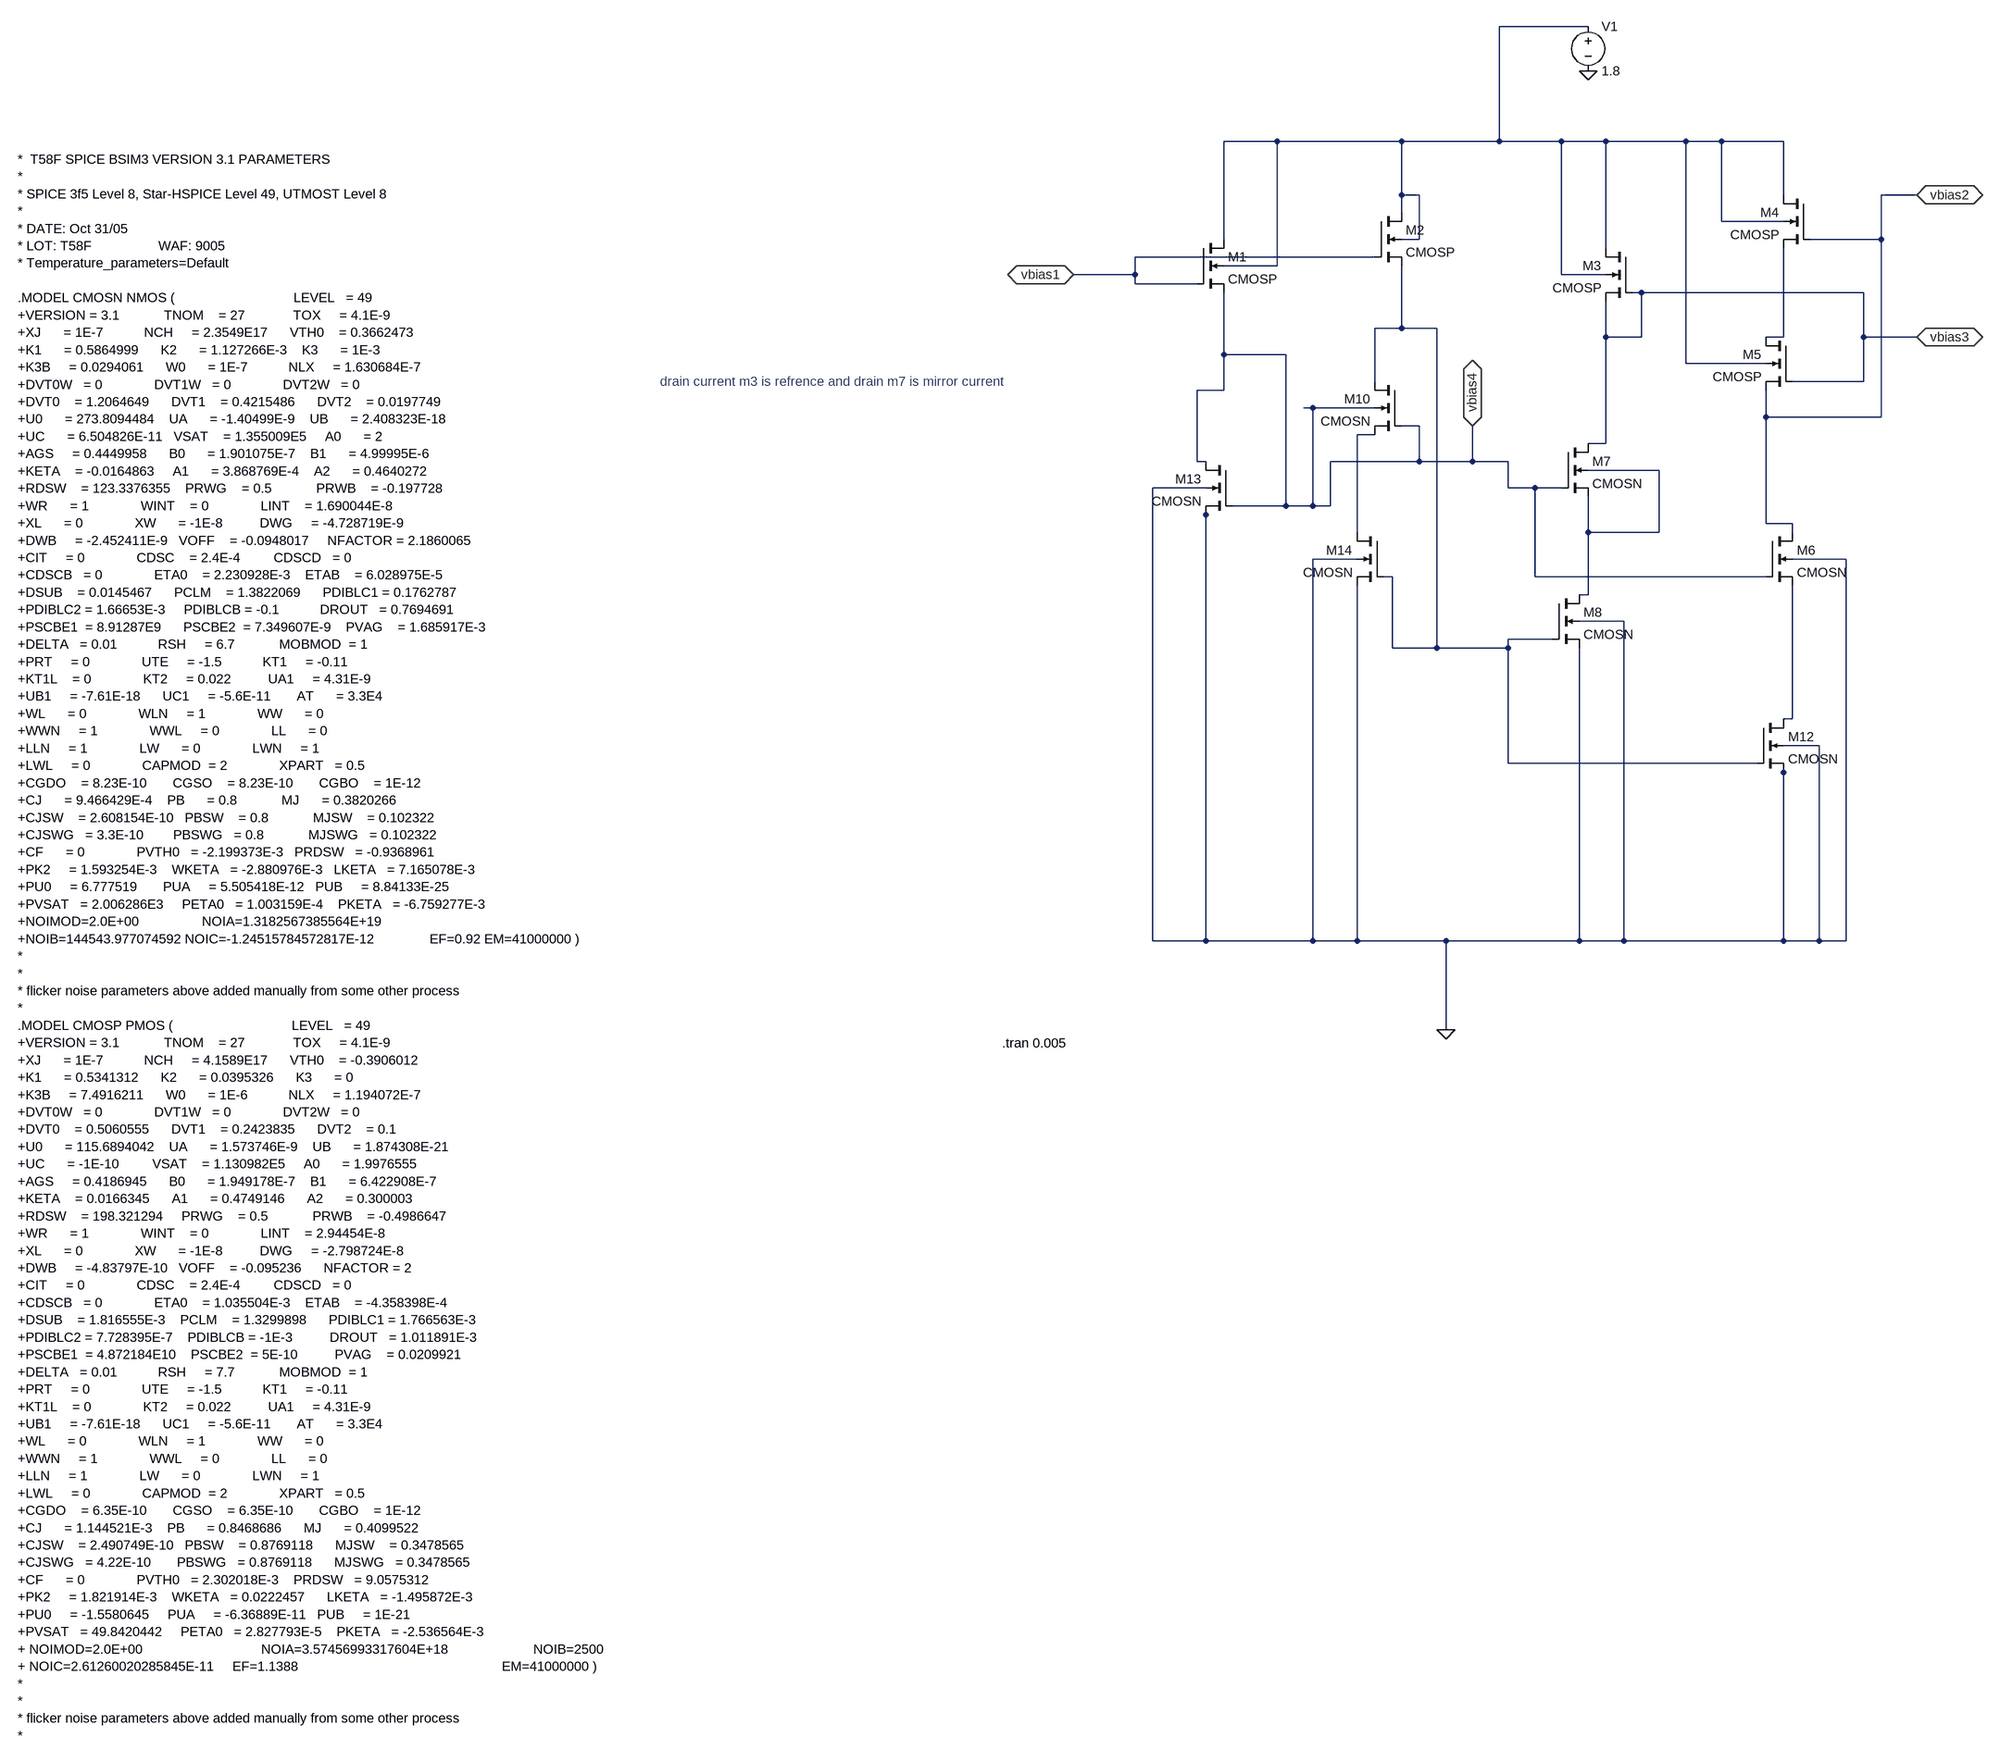
[diagram p0: schematic CURRENTMIRROR.asc]
CURRENTMIRROR.asc, the LTspice schematic file:
Version 4
SHEET 1 1432 2468
WIRE 704 -352 544 -352
WIRE 144 -128 48 -128
WIRE 368 -128 144 -128
WIRE 544 -128 544 -352
WIRE 544 -128 368 -128
WIRE 656 -128 544 -128
WIRE 736 -128 656 -128
WIRE 880 -128 736 -128
WIRE 944 -128 880 -128
WIRE 1056 -128 944 -128
WIRE 368 -32 368 -128
WIRE 400 -32 368 -32
WIRE 1056 -32 1056 -128
WIRE 1296 -32 1232 -32
WIRE 368 0 368 -32
WIRE 944 16 944 -128
WIRE 1056 16 944 16
WIRE 48 48 48 -128
WIRE 400 48 400 -32
WIRE 400 48 368 48
WIRE 1232 48 1232 -32
WIRE 1232 48 1104 48
WIRE 736 64 736 -128
WIRE 320 80 -112 80
WIRE 144 96 144 -128
WIRE 144 96 48 96
WIRE -112 112 -112 80
WIRE -112 112 -256 112
WIRE 656 112 656 -128
WIRE 736 112 656 112
WIRE -112 128 -112 112
WIRE 0 128 -112 128
WIRE 800 144 784 144
WIRE 1200 144 800 144
WIRE 368 208 368 96
WIRE 368 208 320 208
WIRE 432 208 368 208
WIRE 736 224 736 160
WIRE 800 224 800 144
WIRE 800 224 736 224
WIRE 1056 224 1056 64
WIRE 1056 224 1024 224
WIRE 1200 224 1200 144
WIRE 1296 224 1200 224
WIRE 48 256 48 144
WIRE 160 256 48 256
WIRE 880 272 880 -128
WIRE 1024 272 880 272
WIRE 320 304 320 208
WIRE 1200 304 1200 224
WIRE 1200 304 1072 304
WIRE 48 320 48 256
WIRE 48 320 0 320
WIRE 208 352 192 352
WIRE 320 352 208 352
WIRE 1024 368 1024 320
WIRE 1232 368 1232 48
WIRE 1232 368 1024 368
WIRE 400 384 368 384
WIRE 320 400 288 400
WIRE 736 416 736 224
WIRE 736 416 704 416
WIRE 0 448 0 320
WIRE 16 448 0 448
WIRE 400 448 400 384
WIRE 400 448 240 448
WIRE 496 448 496 384
WIRE 496 448 400 448
WIRE 560 448 496 448
WIRE 832 464 704 464
WIRE 16 496 -80 496
WIRE 560 496 560 448
WIRE 608 496 560 496
WIRE 656 496 608 496
WIRE 160 528 160 256
WIRE 160 528 64 528
WIRE 208 528 208 352
WIRE 208 528 160 528
WIRE 240 528 240 448
WIRE 240 528 208 528
WIRE 16 544 16 528
WIRE 1024 560 1024 368
WIRE 1072 560 1024 560
WIRE 288 576 288 400
WIRE 704 576 704 512
WIRE 832 576 832 464
WIRE 832 576 704 576
WIRE 1072 576 1072 560
WIRE 288 624 208 624
WIRE 1168 624 1072 624
WIRE 352 656 336 656
WIRE 608 656 608 496
WIRE 1024 656 608 656
WIRE 704 688 704 576
WIRE 704 688 688 688
WIRE 768 736 688 736
WIRE 640 768 560 768
WIRE 352 784 352 656
WIRE 432 784 432 208
WIRE 432 784 352 784
WIRE 560 784 560 768
WIRE 560 784 432 784
WIRE 1072 912 1072 672
WIRE 1072 912 1056 912
WIRE 1120 960 1056 960
WIRE 560 992 560 784
WIRE 1008 992 560 992
WIRE 1056 1008 1056 992
WIRE -80 1312 -80 496
WIRE 16 1312 16 544
WIRE 16 1312 -80 1312
WIRE 208 1312 208 624
WIRE 208 1312 16 1312
WIRE 288 1312 288 672
WIRE 288 1312 208 1312
WIRE 448 1312 288 1312
WIRE 688 1312 688 784
WIRE 688 1312 448 1312
WIRE 768 1312 768 736
WIRE 768 1312 688 1312
WIRE 1056 1312 1056 1008
WIRE 1056 1312 768 1312
WIRE 1120 1312 1120 960
WIRE 1120 1312 1056 1312
WIRE 1168 1312 1168 624
WIRE 1168 1312 1120 1312
WIRE 448 1472 448 1312
FLAG -256 112 vbias1
IOPIN -256 112 BiDir
FLAG 496 384 vbias4
IOPIN 496 384 BiDir
FLAG 1296 224 vbias3
IOPIN 1296 224 BiDir
FLAG 1296 -32 vbias2
IOPIN 1296 -32 BiDir
FLAG 704 -272 0
FLAG 448 1472 0
DATAFLAG 736 272 ""
DATAFLAG 736 16 ""
SYMBOL nmos4 0 48 R0
SYMATTR InstName M1
SYMATTR Value CMOSP
SYMATTR Value2 l=2u w=24u
SYMBOL nmos4 320 0 R0
SYMATTR InstName M2
SYMATTR Value CMOSP
SYMATTR Value2 l=2u w=24u
SYMBOL nmos4 656 416 R0
SYMATTR InstName M7
SYMATTR Value CMOSN
SYMATTR Value2 l=2u w=10u
SYMBOL nmos4 640 688 R0
SYMATTR InstName M8
SYMATTR Value CMOSN
SYMATTR Value2 l=2u w=10u
SYMBOL nmos4 784 64 M0
SYMATTR InstName M3
SYMATTR Value CMOSP
SYMATTR Value2 l=2u w=24u
SYMBOL nmos4 1104 -32 M0
SYMATTR InstName M4
SYMATTR Value CMOSP
SYMATTR Value2 l=2u w=24u
SYMBOL nmos4 1024 576 R0
SYMATTR InstName M6
SYMATTR Value CMOSN
SYMATTR Value2 l=2u w=10u
SYMBOL nmos4 1008 912 R0
SYMATTR InstName M12
SYMATTR Value CMOSN
SYMATTR Value2 l=2u w=10u
SYMBOL nmos4 368 304 M0
SYMATTR InstName M10
SYMATTR Value CMOSN
SYMATTR Value2 l=2u w=10u
SYMBOL nmos4 64 448 M0
SYMATTR InstName M13
SYMATTR Value CMOSN
SYMATTR Value2 l=2u w=10u
SYMBOL nmos4 336 576 M0
SYMATTR InstName M14
SYMATTR Value CMOSN
SYMATTR Value2 l=2u w=10u
SYMBOL nmos4 1072 224 M0
SYMATTR InstName M5
SYMATTR Value CMOSP
SYMATTR Value2 l=2u w=24u
SYMBOL voltage 704 -368 R0
WINDOW 123 0 0 Left 0
WINDOW 39 0 0 Left 0
SYMATTR InstName V1
SYMATTR Value 1.8
TEXT -384 1496 Left 2 !.tran 0.005
TEXT -4040 -96 Left 2 !*  T58F SPICE BSIM3 VERSION 3.1 PARAMETERS\n* \n* SPICE 3f5 Level 8, Star-HSPICE Level 49, UTMOST Level 8\n* \n* DATE: Oct 31/05\n* LOT: T58F                  WAF: 9005\n* Temperature_parameters=Default\n \n.MODEL CMOSN NMOS (                                LEVEL   = 49\n+VERSION = 3.1            TNOM    = 27             TOX     = 4.1E-9\n+XJ      = 1E-7           NCH     = 2.3549E17      VTH0    = 0.3662473\n+K1      = 0.5864999      K2      = 1.127266E-3    K3      = 1E-3\n+K3B     = 0.0294061      W0      = 1E-7           NLX     = 1.630684E-7\n+DVT0W   = 0              DVT1W   = 0              DVT2W   = 0\n+DVT0    = 1.2064649      DVT1    = 0.4215486      DVT2    = 0.0197749\n+U0      = 273.8094484    UA      = -1.40499E-9    UB      = 2.408323E-18\n+UC      = 6.504826E-11   VSAT    = 1.355009E5     A0      = 2\n+AGS     = 0.4449958      B0      = 1.901075E-7    B1      = 4.99995E-6\n+KETA    = -0.0164863     A1      = 3.868769E-4    A2      = 0.4640272\n+RDSW    = 123.3376355    PRWG    = 0.5            PRWB    = -0.197728\n+WR      = 1              WINT    = 0              LINT    = 1.690044E-8\n+XL      = 0              XW      = -1E-8          DWG     = -4.728719E-9\n+DWB     = -2.452411E-9   VOFF    = -0.0948017     NFACTOR = 2.1860065\n+CIT     = 0              CDSC    = 2.4E-4         CDSCD   = 0\n+CDSCB   = 0              ETA0    = 2.230928E-3    ETAB    = 6.028975E-5\n+DSUB    = 0.0145467      PCLM    = 1.3822069      PDIBLC1 = 0.1762787\n+PDIBLC2 = 1.66653E-3     PDIBLCB = -0.1           DROUT   = 0.7694691\n+PSCBE1  = 8.91287E9      PSCBE2  = 7.349607E-9    PVAG    = 1.685917E-3\n+DELTA   = 0.01           RSH     = 6.7            MOBMOD  = 1\n+PRT     = 0              UTE     = -1.5           KT1     = -0.11\n+KT1L    = 0              KT2     = 0.022          UA1     = 4.31E-9\n+UB1     = -7.61E-18      UC1     = -5.6E-11       AT      = 3.3E4\n+WL      = 0              WLN     = 1              WW      = 0\n+WWN     = 1              WWL     = 0              LL      = 0\n+LLN     = 1              LW      = 0              LWN     = 1\n+LWL     = 0              CAPMOD  = 2              XPART   = 0.5\n+CGDO    = 8.23E-10       CGSO    = 8.23E-10       CGBO    = 1E-12\n+CJ      = 9.466429E-4    PB      = 0.8            MJ      = 0.3820266\n+CJSW    = 2.608154E-10   PBSW    = 0.8            MJSW    = 0.102322\n+CJSWG   = 3.3E-10        PBSWG   = 0.8            MJSWG   = 0.102322\n+CF      = 0              PVTH0   = -2.199373E-3   PRDSW   = -0.9368961\n+PK2     = 1.593254E-3    WKETA   = -2.880976E-3   LKETA   = 7.165078E-3\n+PU0     = 6.777519       PUA     = 5.505418E-12   PUB     = 8.84133E-25\n+PVSAT   = 2.006286E3     PETA0   = 1.003159E-4    PKETA   = -6.759277E-3\n+NOIMOD=2.0E+00                 NOIA=1.3182567385564E+19\n+NOIB=144543.977074592 NOIC=-1.24515784572817E-12               EF=0.92 EM=41000000 )\n*\n*\n* flicker noise parameters above added manually from some other process\n* \n.MODEL CMOSP PMOS (                                LEVEL   = 49\n+VERSION = 3.1            TNOM    = 27             TOX     = 4.1E-9\n+XJ      = 1E-7           NCH     = 4.1589E17      VTH0    = -0.3906012\n+K1      = 0.5341312      K2      = 0.0395326      K3      = 0\n+K3B     = 7.4916211      W0      = 1E-6           NLX     = 1.194072E-7\n+DVT0W   = 0              DVT1W   = 0              DVT2W   = 0\n+DVT0    = 0.5060555      DVT1    = 0.2423835      DVT2    = 0.1\n+U0      = 115.6894042    UA      = 1.573746E-9    UB      = 1.874308E-21\n+UC      = -1E-10         VSAT    = 1.130982E5     A0      = 1.9976555\n+AGS     = 0.4186945      B0      = 1.949178E-7    B1      = 6.422908E-7\n+KETA    = 0.0166345      A1      = 0.4749146      A2      = 0.300003\n+RDSW    = 198.321294     PRWG    = 0.5            PRWB    = -0.4986647\n+WR      = 1              WINT    = 0              LINT    = 2.94454E-8\n+XL      = 0              XW      = -1E-8          DWG     = -2.798724E-8\n+DWB     = -4.83797E-10   VOFF    = -0.095236      NFACTOR = 2\n+CIT     = 0              CDSC    = 2.4E-4         CDSCD   = 0\n+CDSCB   = 0              ETA0    = 1.035504E-3    ETAB    = -4.358398E-4\n+DSUB    = 1.816555E-3    PCLM    = 1.3299898      PDIBLC1 = 1.766563E-3\n+PDIBLC2 = 7.728395E-7    PDIBLCB = -1E-3          DROUT   = 1.011891E-3\n+PSCBE1  = 4.872184E10    PSCBE2  = 5E-10          PVAG    = 0.0209921\n+DELTA   = 0.01           RSH     = 7.7            MOBMOD  = 1\n+PRT     = 0              UTE     = -1.5           KT1     = -0.11\n+KT1L    = 0              KT2     = 0.022          UA1     = 4.31E-9\n+UB1     = -7.61E-18      UC1     = -5.6E-11       AT      = 3.3E4\n+WL      = 0              WLN     = 1              WW      = 0\n+WWN     = 1              WWL     = 0              LL      = 0\n+LLN     = 1              LW      = 0              LWN     = 1\n+LWL     = 0              CAPMOD  = 2              XPART   = 0.5\n+CGDO    = 6.35E-10       CGSO    = 6.35E-10       CGBO    = 1E-12\n+CJ      = 1.144521E-3    PB      = 0.8468686      MJ      = 0.4099522\n+CJSW    = 2.490749E-10   PBSW    = 0.8769118      MJSW    = 0.3478565\n+CJSWG   = 4.22E-10       PBSWG   = 0.8769118      MJSWG   = 0.3478565\n+CF      = 0              PVTH0   = 2.302018E-3    PRDSW   = 9.0575312\n+PK2     = 1.821914E-3    WKETA   = 0.0222457      LKETA   = -1.495872E-3\n+PU0     = -1.5580645     PUA     = -6.36889E-11   PUB     = 1E-21\n+PVSAT   = 49.8420442     PETA0   = 2.827793E-5    PKETA   = -2.536564E-3 \n+ NOIMOD=2.0E+00                                NOIA=3.57456993317604E+18                       NOIB=2500\n+ NOIC=2.61260020285845E-11     EF=1.1388                                                       EM=41000000 )\n*\n*\n* flicker noise parameters above added manually from some other process\n*
TEXT -1000 304 Left 2 ;drain current m3 is refrence and drain m7 is mirror current

The netlist it stands for:
* CURRENTMIRROR.asc
M1 N001 vbias1 vbias4 N001 CMOSP l=2u w=24u
M2 N001 vbias1 N002 N001 CMOSP l=2u w=24u
M7 vbias3 vbias4 N005 N005 CMOSN l=2u w=10u
M8 N005 N002 0 0 CMOSN l=2u w=10u
M3 N001 vbias3 vbias3 N001 CMOSP l=2u w=24u
M4 N001 vbias2 N003 N001 CMOSP l=2u w=24u
M6 vbias2 vbias4 N006 0 CMOSN l=2u w=10u
M12 N006 N002 0 0 CMOSN l=2u w=10u
M10 N002 vbias4 N004 vbias4 CMOSN l=2u w=10u
M13 vbias4 vbias4 0 0 CMOSN l=2u w=10u
M14 N004 N002 0 0 CMOSN l=2u w=10u
M5 N003 vbias3 vbias2 N001 CMOSP l=2u w=24u
V1 N001 0 1.8
.model NMOS NMOS
.model PMOS PMOS
.lib standard.mos
.tran 0.005
*  T58F SPICE BSIM3 VERSION 3.1 PARAMETERS
*
* SPICE 3f5 Level 8, Star-HSPICE Level 49, UTMOST Level 8
*
* DATE: Oct 31/05
* LOT: T58F                  WAF: 9005
* Temperature_parameters=Default
.MODEL CMOSN NMOS (                                LEVEL   = 49
+VERSION = 3.1            TNOM    = 27             TOX     = 4.1E-9
+XJ      = 1E-7           NCH     = 2.3549E17      VTH0    = 0.3662473
+K1      = 0.5864999      K2      = 1.127266E-3    K3      = 1E-3
+K3B     = 0.0294061      W0      = 1E-7           NLX     = 1.630684E-7
+DVT0W   = 0              DVT1W   = 0              DVT2W   = 0
+DVT0    = 1.2064649      DVT1    = 0.4215486      DVT2    = 0.0197749
+U0      = 273.8094484    UA      = -1.40499E-9    UB      = 2.408323E-18
+UC      = 6.504826E-11   VSAT    = 1.355009E5     A0      = 2
+AGS     = 0.4449958      B0      = 1.901075E-7    B1      = 4.99995E-6
+KETA    = -0.0164863     A1      = 3.868769E-4    A2      = 0.4640272
+RDSW    = 123.3376355    PRWG    = 0.5            PRWB    = -0.197728
+WR      = 1              WINT    = 0              LINT    = 1.690044E-8
+XL      = 0              XW      = -1E-8          DWG     = -4.728719E-9
+DWB     = -2.452411E-9   VOFF    = -0.0948017     NFACTOR = 2.1860065
+CIT     = 0              CDSC    = 2.4E-4         CDSCD   = 0
+CDSCB   = 0              ETA0    = 2.230928E-3    ETAB    = 6.028975E-5
+DSUB    = 0.0145467      PCLM    = 1.3822069      PDIBLC1 = 0.1762787
+PDIBLC2 = 1.66653E-3     PDIBLCB = -0.1           DROUT   = 0.7694691
+PSCBE1  = 8.91287E9      PSCBE2  = 7.349607E-9    PVAG    = 1.685917E-3
+DELTA   = 0.01           RSH     = 6.7            MOBMOD  = 1
+PRT     = 0              UTE     = -1.5           KT1     = -0.11
+KT1L    = 0              KT2     = 0.022          UA1     = 4.31E-9
+UB1     = -7.61E-18      UC1     = -5.6E-11       AT      = 3.3E4
+WL      = 0              WLN     = 1              WW      = 0
+WWN     = 1              WWL     = 0              LL      = 0
+LLN     = 1              LW      = 0              LWN     = 1
+LWL     = 0              CAPMOD  = 2              XPART   = 0.5
+CGDO    = 8.23E-10       CGSO    = 8.23E-10       CGBO    = 1E-12
+CJ      = 9.466429E-4    PB      = 0.8            MJ      = 0.3820266
+CJSW    = 2.608154E-10   PBSW    = 0.8            MJSW    = 0.102322
+CJSWG   = 3.3E-10        PBSWG   = 0.8            MJSWG   = 0.102322
+CF      = 0              PVTH0   = -2.199373E-3   PRDSW   = -0.9368961
+PK2     = 1.593254E-3    WKETA   = -2.880976E-3   LKETA   = 7.165078E-3
+PU0     = 6.777519       PUA     = 5.505418E-12   PUB     = 8.84133E-25
+PVSAT   = 2.006286E3     PETA0   = 1.003159E-4    PKETA   = -6.759277E-3
+NOIMOD=2.0E+00                 NOIA=1.3182567385564E+19
+NOIB=144543.977074592 NOIC=-1.24515784572817E-12               EF=0.92 EM=41000000 )
*
*
* flicker noise parameters above added manually from some other process
*
.MODEL CMOSP PMOS (                                LEVEL   = 49
+VERSION = 3.1            TNOM    = 27             TOX     = 4.1E-9
+XJ      = 1E-7           NCH     = 4.1589E17      VTH0    = -0.3906012
+K1      = 0.5341312      K2      = 0.0395326      K3      = 0
+K3B     = 7.4916211      W0      = 1E-6           NLX     = 1.194072E-7
+DVT0W   = 0              DVT1W   = 0              DVT2W   = 0
+DVT0    = 0.5060555      DVT1    = 0.2423835      DVT2    = 0.1
+U0      = 115.6894042    UA      = 1.573746E-9    UB      = 1.874308E-21
+UC      = -1E-10         VSAT    = 1.130982E5     A0      = 1.9976555
+AGS     = 0.4186945      B0      = 1.949178E-7    B1      = 6.422908E-7
+KETA    = 0.0166345      A1      = 0.4749146      A2      = 0.300003
+RDSW    = 198.321294     PRWG    = 0.5            PRWB    = -0.4986647
+WR      = 1              WINT    = 0              LINT    = 2.94454E-8
+XL      = 0              XW      = -1E-8          DWG     = -2.798724E-8
+DWB     = -4.83797E-10   VOFF    = -0.095236      NFACTOR = 2
+CIT     = 0              CDSC    = 2.4E-4         CDSCD   = 0
+CDSCB   = 0              ETA0    = 1.035504E-3    ETAB    = -4.358398E-4
+DSUB    = 1.816555E-3    PCLM    = 1.3299898      PDIBLC1 = 1.766563E-3
+PDIBLC2 = 7.728395E-7    PDIBLCB = -1E-3          DROUT   = 1.011891E-3
+PSCBE1  = 4.872184E10    PSCBE2  = 5E-10          PVAG    = 0.0209921
+DELTA   = 0.01           RSH     = 7.7            MOBMOD  = 1
+PRT     = 0              UTE     = -1.5           KT1     = -0.11
+KT1L    = 0              KT2     = 0.022          UA1     = 4.31E-9
+UB1     = -7.61E-18      UC1     = -5.6E-11       AT      = 3.3E4
+WL      = 0              WLN     = 1              WW      = 0
+WWN     = 1              WWL     = 0              LL      = 0
+LLN     = 1              LW      = 0              LWN     = 1
+LWL     = 0              CAPMOD  = 2              XPART   = 0.5
+CGDO    = 6.35E-10       CGSO    = 6.35E-10       CGBO    = 1E-12
+CJ      = 1.144521E-3    PB      = 0.8468686      MJ      = 0.4099522
+CJSW    = 2.490749E-10   PBSW    = 0.8769118      MJSW    = 0.3478565
+CJSWG   = 4.22E-10       PBSWG   = 0.8769118      MJSWG   = 0.3478565
+CF      = 0              PVTH0   = 2.302018E-3    PRDSW   = 9.0575312
+PK2     = 1.821914E-3    WKETA   = 0.0222457      LKETA   = -1.495872E-3
+PU0     = -1.5580645     PUA     = -6.36889E-11   PUB     = 1E-21
+PVSAT   = 49.8420442     PETA0   = 2.827793E-5    PKETA   = -2.536564E-3
+ NOIMOD=2.0E+00                                NOIA=3.57456993317604E+18                       NOIB=2500
+ NOIC=2.61260020285845E-11     EF=1.1388                                                       EM=41000000 )
*
*
* flicker noise parameters above added manually from some other process
*
* drain current m3 is refrence and drain m7 is mirror current
.backanno
.end